# Altium schematic sheet 04.Power Tree.SchDoc
size 594 x 420 mm; Revision: V2.1; Schematic Page Number: 11; Page Number: 5; Check: Default; Schematic Name: RK_NVR_DEMO1_RK3588_LP4/4x_V21; Page Count: 43; Page name: 04.Power Tree; Designer: Zhangdz; Schematic Page Count: 99; Revcode: V2.1; DsnPath: E:\Work\SBER\RK3588_SOM\temp\RK_NVR_DEMO1_RK3588_LP4XD200P232SD8_V21_20211228.DSN; SchematicName: RK_NVR_DEMO1_RK3588_LP4/4x_V21; PageName: 04.Power Tree; PageSize: A2; TopSchematic: True
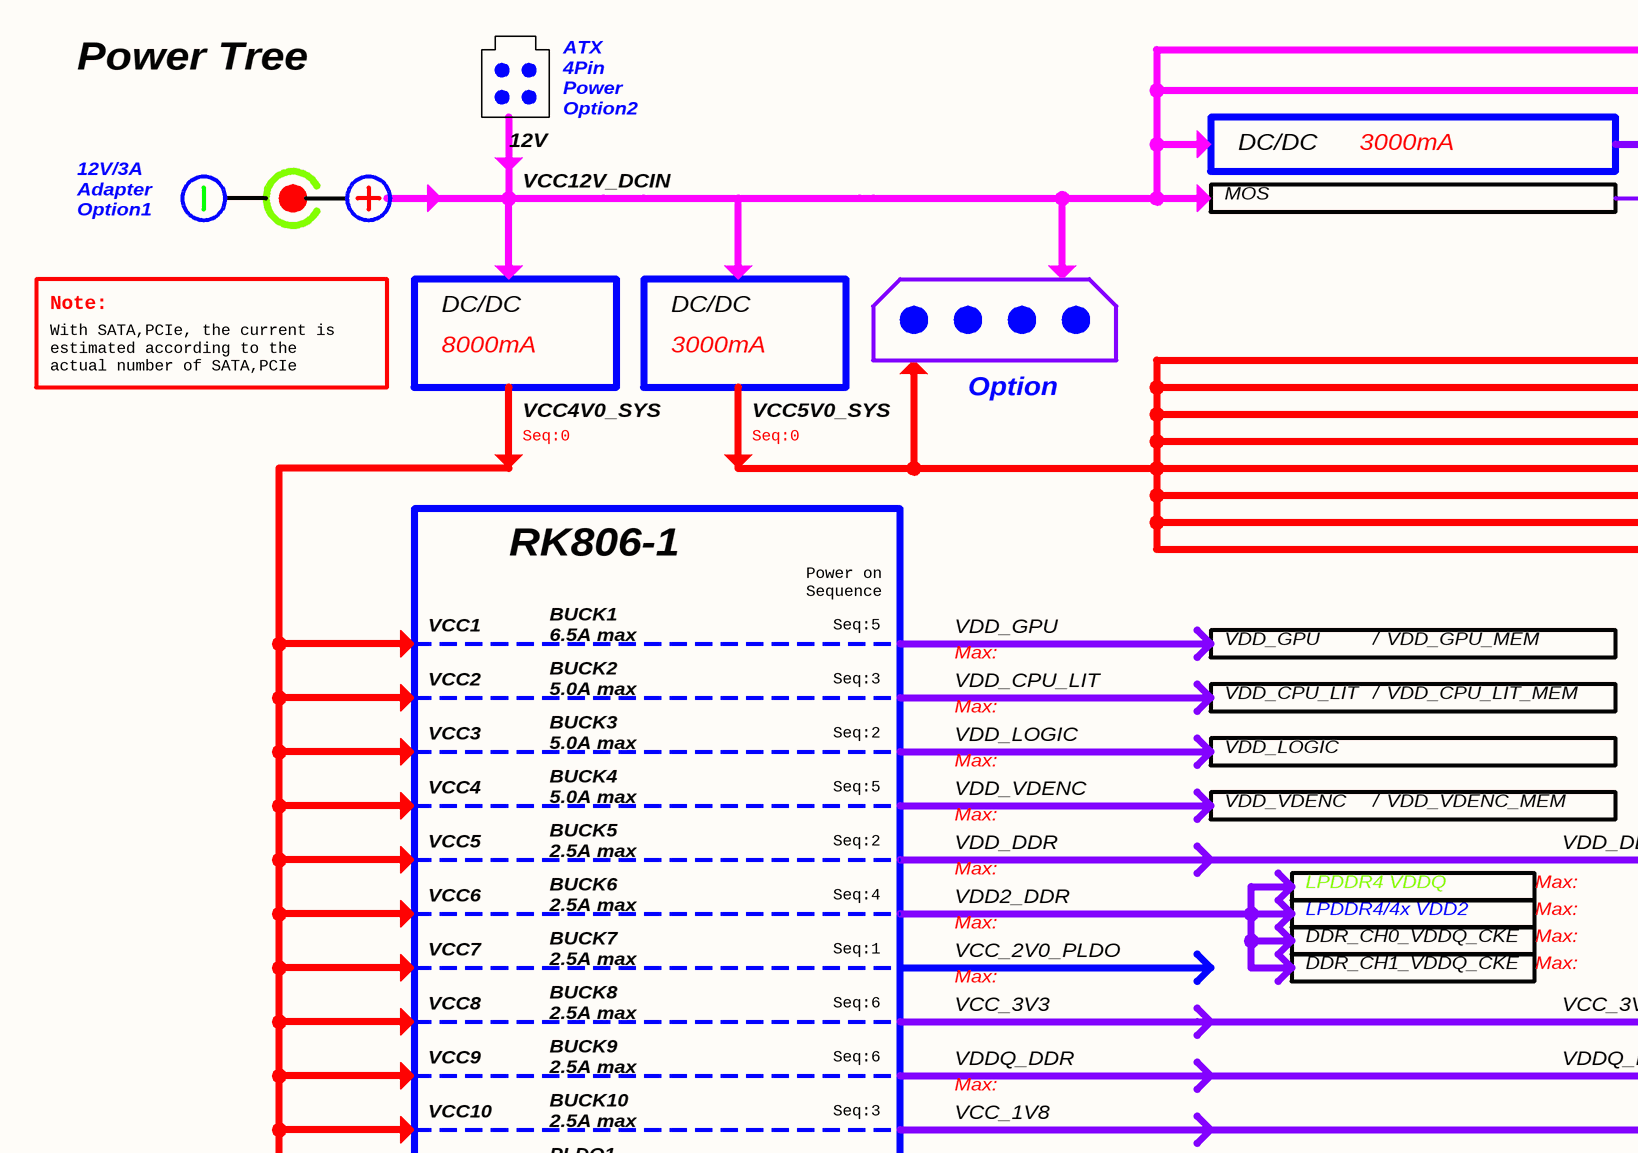
[diagram p0: 04.Power Tree.SchDoc, top left]
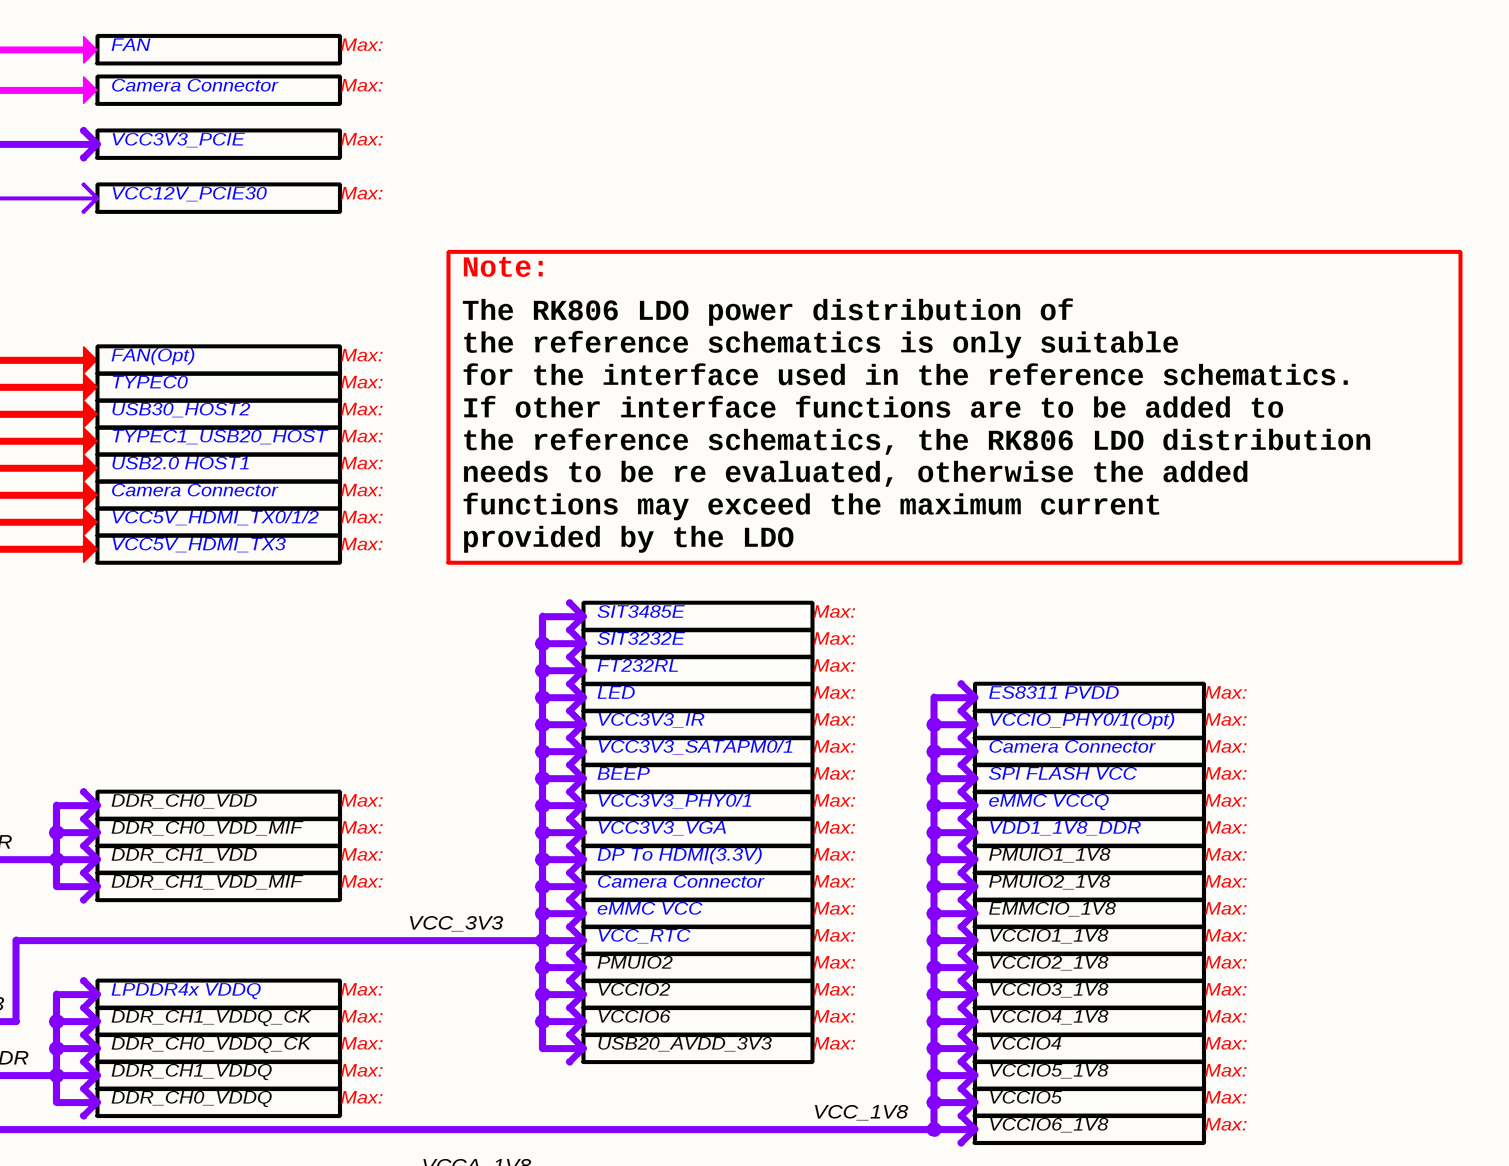
[diagram p1: 04.Power Tree.SchDoc, top right]
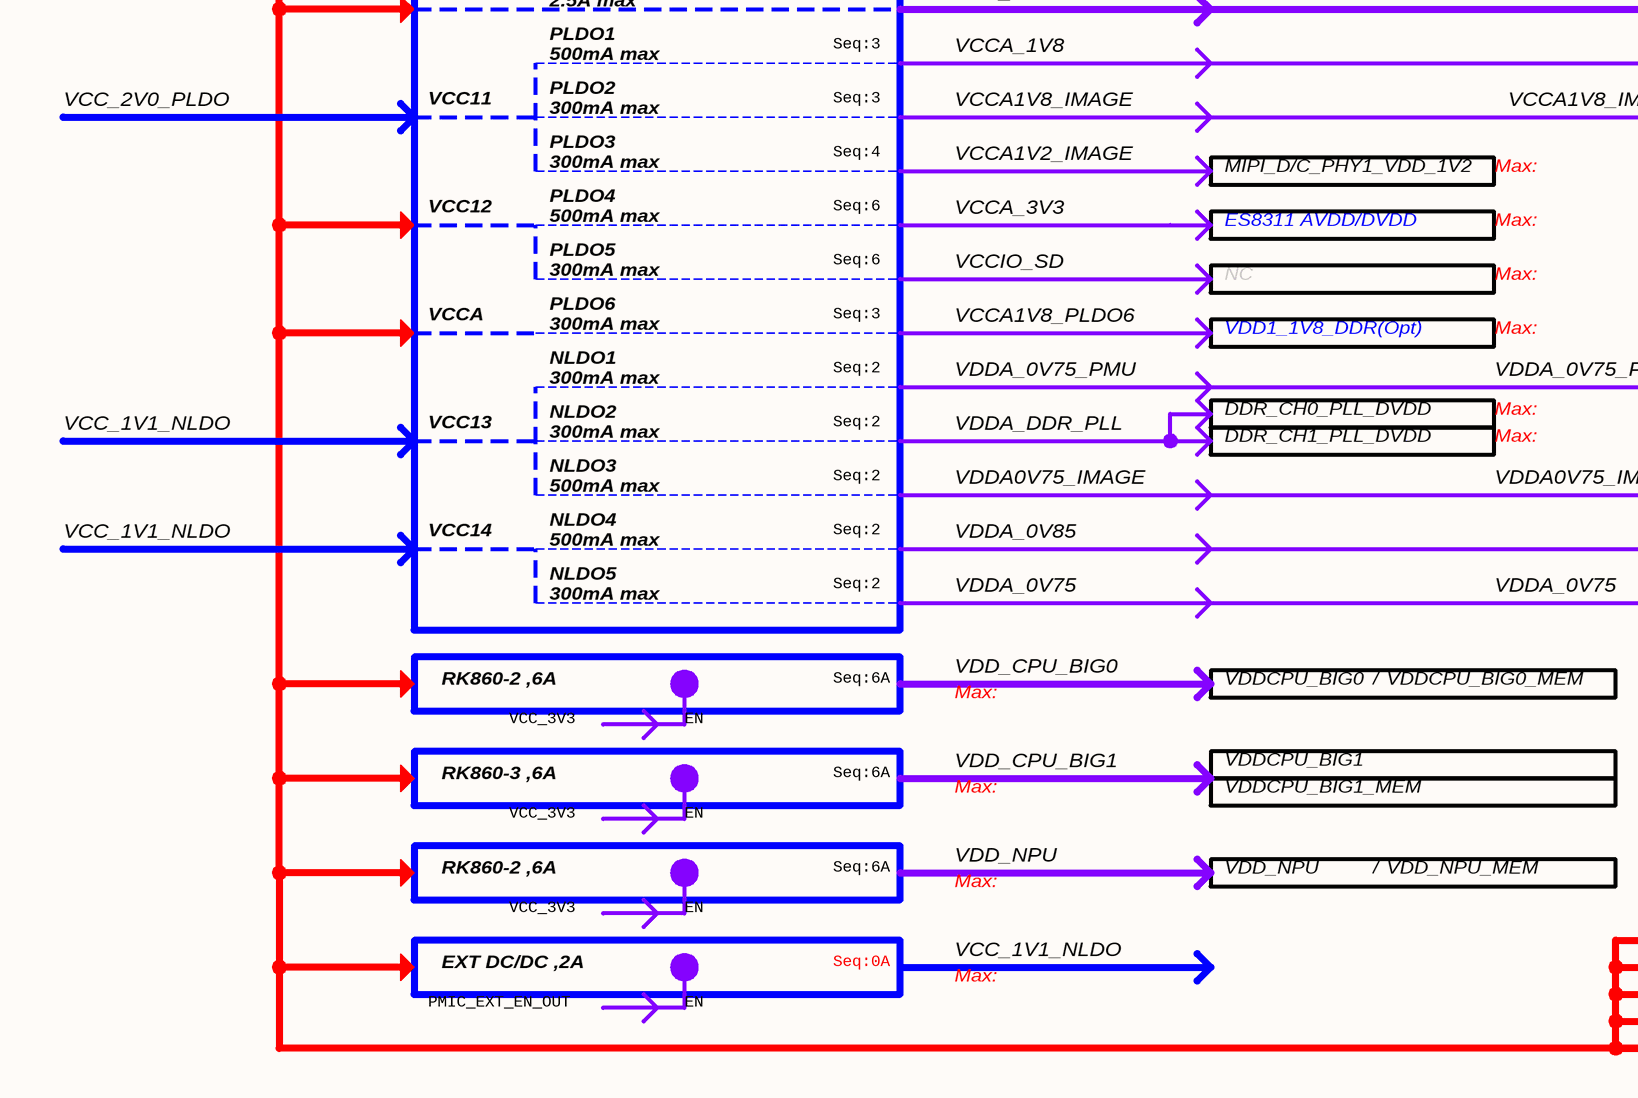
[diagram p2: 04.Power Tree.SchDoc, bottom left]
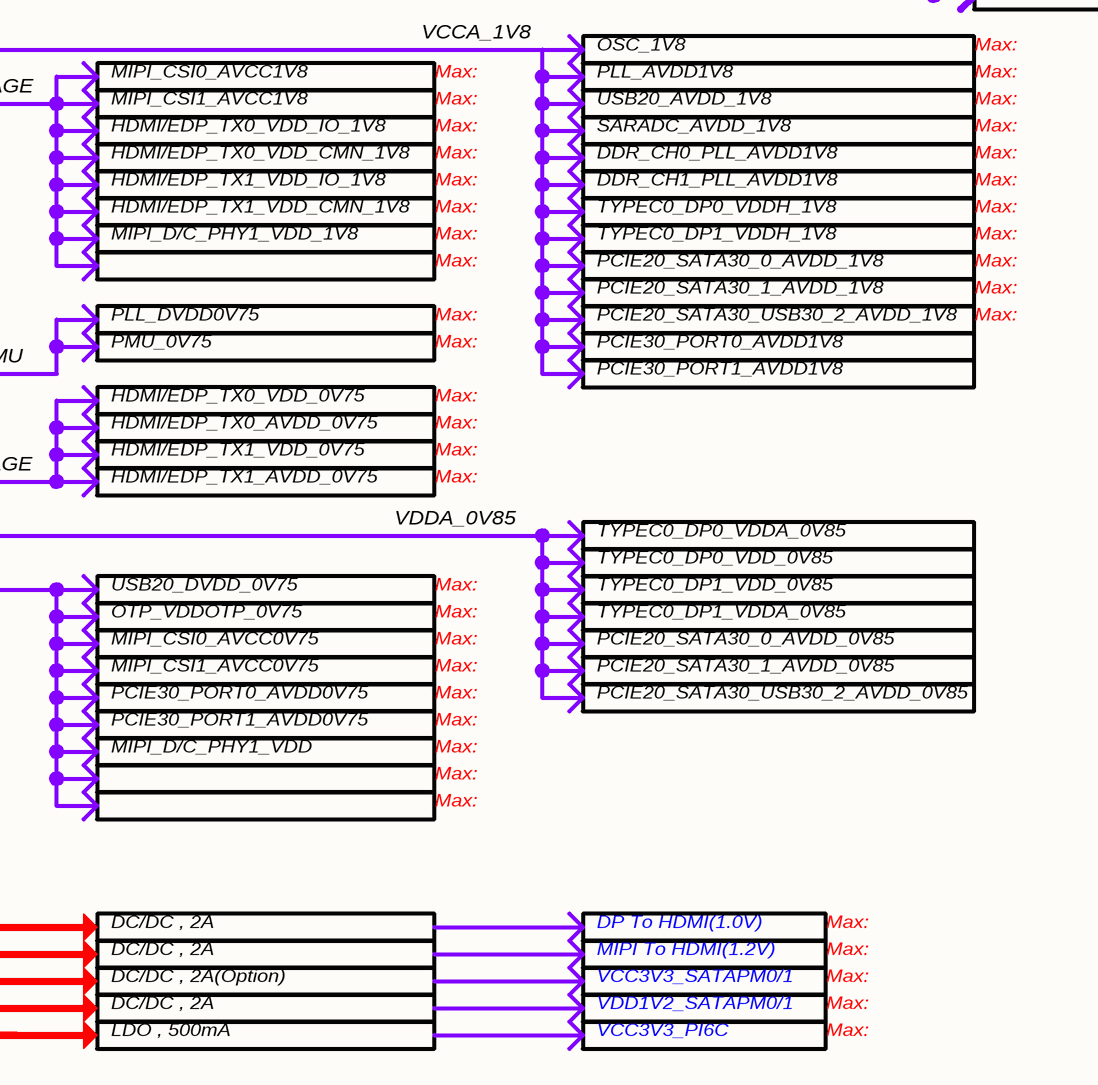
[diagram p3: 04.Power Tree.SchDoc, bottom right]

## Notes on the sheet
- Power Tree
- Camera Connector
- FAN
- Max:
- 12V
- ATX
  4Pin
  Power
  Option2
- DC/DC
- 3000mA
- VCC3V3_PCIE
- 12V/3A
  Adapter
  Option1
- VCC12V_DCIN
- MOS
- VCC12V_PCIE30
- Note:
- 8000mA
- FAN(Opt)
- With SATA,PCIe, the current is
  estimated according to the
  actual number of SATA,PCIe
- VCC4V0_SYS
- VCC5V0_SYS
- Option
- USB30_HOST2
- TYPEC0
- Seq:0
- USB2.0 HOST1
- TYPEC1_USB20_HOST
- RK806-1
- VCC5V_HDMI_TX0/1/2
- VCC5V_HDMI_TX3
- The RK806 LDO power distribution of
  the reference schematics is only suitable
  for the interface used in the reference schematics.
  If other interface functions are to be added to
  the reference schematics, the RK806 LDO distribution
  needs to be re evaluated, otherwise the added
  functions may exceed the maximum current
  provided by the LDO
- VCC1
- Power on
  Sequence
- Seq:5
- SIT3485E
- VCC2
- BUCK1
  6.5A max
- BUCK2
  5.0A max
- Seq:3
- VDD_CPU_LIT
- VDD_GPU
- /
- VDD_GPU_MEM
- FT232RL
- SIT3232E
- VCC3
- BUCK3
  5.0A max
- Seq:2
- VDD_LOGIC
- VDD_CPU_LIT_MEM
- VCC3V3_SATAPM0/1
- VCC3V3_IR
- LED
- VCCIO_PHY0/1(Opt)
- ES8311 PVDD
- VCC4
- BUCK4
  5.0A max
- VDD_VDENC
- VDD_VDENC_MEM
- DDR_CH0_VDD
- VCC3V3_PHY0/1
- BEEP
- eMMC VCCQ
- SPI FLASH VCC
- VCC5
- VCC6
- BUCK5
  2.5A max
- Seq:4
- VDD_DDR
- LPDDR4 VDDQ
- DDR_CH0_VDD_MIF
- DDR_CH1_VDD_MIF
- DDR_CH1_VDD
- DP To HDMI(3.3V)
- VCC3V3_VGA
- VDD1_1V8_DDR
- PMUIO1_1V8
- PMUIO2_1V8
- VCC7
- BUCK7
  2.5A max
- BUCK6
  2.5A max
- Seq:1
- VDD2_DDR
- VCC_2V0_PLDO
- DDR_CH0_VDDQ_CKE
- LPDDR4/4x VDD2
- VCC_3V3
- VCC_RTC
- eMMC VCC
- EMMCIO_1V8
- VCCIO1_1V8
- VCC8
- BUCK8
  2.5A max
- Seq:6
- DDR_CH1_VDDQ_CKE
- DDR_CH1_VDDQ_CK
- LPDDR4x VDDQ
- PMUIO2
- VCCIO2
- VCCIO6
- VCCIO2_1V8
- VCCIO3_1V8
- VCCIO4_1V8
- VCC9
- BUCK9
  2.5A max
- VDDQ_DDR
- DDR_CH0_VDDQ_CK
- DDR_CH1_VDDQ
- USB20_AVDD_3V3
- VCCIO5_1V8
- VCCIO4
- VCC10
- BUCK10
  2.5A max
- VCC_1V8
- DDR_CH0_VDDQ
- VCCIO5
- VCCIO6_1V8
- VCC11
- PLDO1
  500mA max
- PLDO2
  300mA max
- VCCA_1V8
- VCCA1V8_IMAGE
- MIPI_CSI0_AVCC1V8
- OSC_1V8
- PLL_AVDD1V8
- PLDO3
  300mA max
- VCCA1V2_IMAGE
- MIPI_D/C_PHY1_VDD_1V2
- MIPI_CSI1_AVCC1V8
- HDMI/EDP_TX0_VDD_IO_1V8
- HDMI/EDP_TX0_VDD_CMN_1V8
- DDR_CH0_PLL_AVDD1V8
- USB20_AVDD_1V8
- SARADC_AVDD_1V8
- VCC12
- PLDO4
  500mA max
- VCCA_3V3
- ES8311 AVDD/DVDD
- HDMI/EDP_TX1_VDD_IO_1V8
- HDMI/EDP_TX1_VDD_CMN_1V8
- DDR_CH1_PLL_AVDD1V8
- TYPEC0_DP0_VDDH_1V8
- VCCA
- PLDO5
  300mA max
- VCCIO_SD
- NC
- MIPI_D/C_PHY1_VDD_1V8
- TYPEC0_DP1_VDDH_1V8
- PCIE20_SATA30_0_AVDD_1V8
- PCIE20_SATA30_1_AVDD_1V8
- PLDO6
  300mA max
- NLDO1
  300mA max
- VDDA_0V75_PMU
- VCCA1V8_PLDO6
- VDD1_1V8_DDR(Opt)
- PLL_DVDD0V75
- PMU_0V75
- PCIE20_SATA30_USB30_2_AVDD_1V8
- PCIE30_PORT0_AVDD1V8
- VCC_1V1_NLDO
- VCC13
- NLDO2
  300mA max
- VDDA_DDR_PLL
- DDR_CH0_PLL_DVDD
- DDR_CH1_PLL_DVDD
- HDMI/EDP_TX0_VDD_0V75
- HDMI/EDP_TX0_AVDD_0V75
- PCIE30_PORT1_AVDD1V8
- NLDO3
  500mA max
- VDDA0V75_IMAGE
- HDMI/EDP_TX1_VDD_0V75
- HDMI/EDP_TX1_AVDD_0V75
- VCC14
- NLDO4
  500mA max
- VDDA_0V85
- TYPEC0_DP0_VDD_0V85
- TYPEC0_DP0_VDDA_0V85
- NLDO5
  300mA max
- VDDA_0V75
- USB20_DVDD_0V75
- OTP_VDDOTP_0V75
- TYPEC0_DP1_VDDA_0V85
- TYPEC0_DP1_VDD_0V85
- RK860-2 ,6A
- EN
- Seq:6A
- VDD_CPU_BIG0
- VDDCPU_BIG0
- VDDCPU_BIG0_MEM
- MIPI_CSI0_AVCC0V75
- MIPI_CSI1_AVCC0V75
- PCIE30_PORT0_AVDD0V75
- PCIE20_SATA30_0_AVDD_0V85
- PCIE20_SATA30_1_AVDD_0V85
- PCIE20_SATA30_USB30_2_AVDD_0V85
- RK860-3 ,6A
- VDD_CPU_BIG1
- VDDCPU_BIG1
- MIPI_D/C_PHY1_VDD
- PCIE30_PORT1_AVDD0V75
- VDDCPU_BIG1_MEM
- VDD_NPU
- VDD_NPU_MEM
- EXT DC/DC ,2A
- Seq:0A
- DC/DC , 2A(Option)
- DC/DC , 2A
- DP To HDMI(1.0V)
- MIPI To HDMI(1.2V)
- PMIC_EXT_EN_OUT
- LDO , 500mA
- VCC3V3_PI6C
- VDD1V2_SATAPM0/1